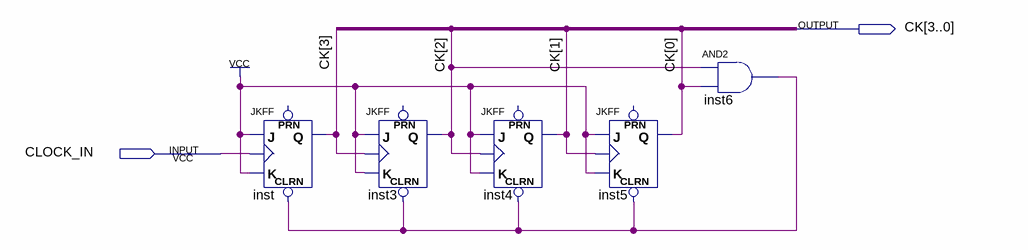
[diagram p0: schematic sheet]
// Quartus schematic counter_mod_10.bdf as structural Verilog: 5 symbols, 2 pins
module counter_mod_10 (
  input  CLOCK_IN,
  output [3:0] CK
);

  wire inst6_out;

  JKFF inst (.CLRN(inst6_out), .K(1'b1), .J(1'b1), .CLK(CLOCK_IN), .Q(CK[3]));  // open: PRN
  JKFF inst3 (.CLRN(inst6_out), .K(1'b1), .J(1'b1), .CLK(CK[3]), .Q(CK[2]));  // open: PRN
  JKFF inst4 (.CLRN(inst6_out), .K(1'b1), .J(1'b1), .CLK(CK[2]), .Q(CK[1]));  // open: PRN
  JKFF inst5 (.CLRN(inst6_out), .K(1'b1), .J(1'b1), .CLK(CK[1]), .Q(CK[0]));  // open: PRN
  and inst6 (inst6_out, CK[2], CK[0]);
endmodule
